# Altium schematic sheet FMCio_rowsCDGH.SchDoc
size Letter; PageSetup: Record=PageOptions|CenterHorizontal=True|CenterVertical=True|PrintScale=0.91|XCorrection=1.00|YCorrection=1.00|PrintKind=0|BorderSize=5000000|LeftOffset=0|BottomOffset=0|Orientation=2|PaperLength=1000|PaperWidth=1000|Scale=100|PaperSource=7|PrintQuality=-4|MediaType=1|DitherType=10|PaperKind=Letter|PrintScaleMode=1; Author: Adam Gilbert; CompanyName: McGill University; DrawnBy: Adam Gilbert; Organization: Altium Limited; Address1: McGill Cosmology; Address2: 3600 University Street; Address3: Montreal, Quebec; Address4: Canada; DocumentNumber: 12; Revision: Rev2; SheetNumber: 12; SheetTotal: 16; ProjectTitle: DfMux FMC Mezz; ModelNumber: MGMEZZ04; ProjectName: DfMux FMC Mezz
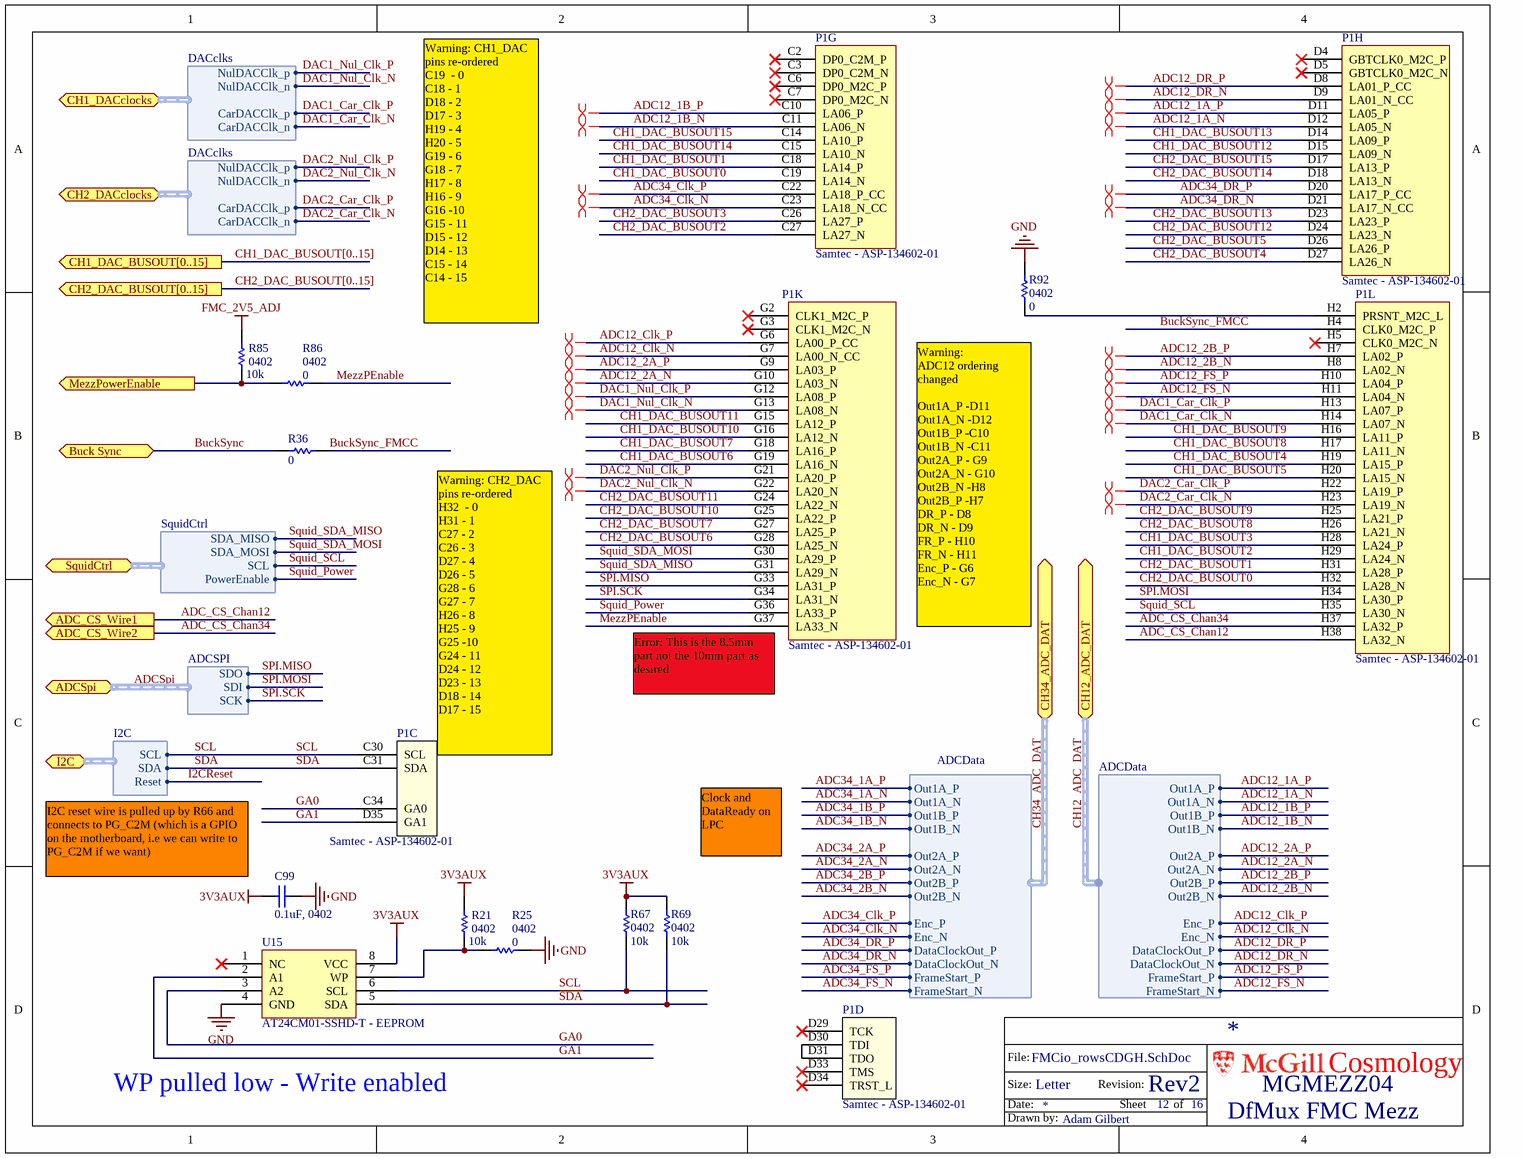
[diagram p0: FMCio_rowsCDGH.SchDoc]

## Parts
C99  0.1uF, 0402  [0402]
P1  Samtec - ASP-134602-01  [BTB-SM1-27-2V400M]  (parts C,D,G,H,K,L of 14)
R21  10k  [0402]
R25  0  [0402]
R36  0  [0805]
R67  10k  [0402]
R69  10k  [0402]
R85  10k  [0402]
R86  0  [0402]
R92  0  [0402]
U15  AT24CM01-SSHD-T - EEPROM  [SO8/L200]

## Ports
ADC_CS_Wire1 (out), ADC_CS_Wire2 (out), ADCSpi (harness ADCSPI), Buck Sync, CH1_DAC_BUSOUT[0..15] (out), CH1_DACclocks (harness DACclks), CH2_DAC_BUSOUT[0..15] (out), CH2_DACclocks (harness DACclks), CH12_ADC_DAT (harness ADCData), CH34_ADC_DAT (harness ADCData), I2C (harness I2C), MezzPowerEnable (out), SquidCtrl (harness SquidCtrl)

## Harnesses
I2C: SCL, SDA, Reset
ADCSPI: SDO, SDI, SCK
ADCData: Enc_P, Enc_N, Out1A_P, Out1A_N, Out1B_P, Out1B_N, Out2A_P, Out2A_N, Out2B_P, Out2B_N, DataClockOut_P, DataClockOut_N, FrameStart_P, FrameStart_N
DACclks: NulDACClk_p, NulDACClk_n, CarDACClk_p, CarDACClk_n
SquidCtrl: SDA_MISO, SDA_MOSI, SCL, PowerEnable

## Nets
3V3AUX: C99.1 R21.1 R67.1 R69.1 U15.8(VCC)
FMC_2V5_ADJ: R85.1
GND: C99.2 R25.2 R92.2 U15.4(GND)
~{SDA}: P1.C31(SDA) R69.2 U15.5(SDA) ; port I2C.SDA  [also labelled SDA]
ADC12_1A_N: P1.D12(LA05_N) ; port CH12_ADC_DAT.Out1A_N
ADC12_1A_P: P1.D11(LA05_P) ; port CH12_ADC_DAT.Out1A_P
ADC12_1B_N: P1.C11(LA06_N) ; port CH12_ADC_DAT.Out1B_N
ADC12_1B_P: P1.C10(LA06_P) ; port CH12_ADC_DAT.Out1B_P
ADC12_2A_N: P1.G10(LA03_N) ; port CH12_ADC_DAT.Out2A_N
ADC12_2A_P: P1.G9(LA03_P) ; port CH12_ADC_DAT.Out2A_P
ADC12_2B_N: P1.H8(LA02_N) ; port CH12_ADC_DAT.Out2B_N
ADC12_2B_P: P1.H7(LA02_P) ; port CH12_ADC_DAT.Out2B_P
ADC12_Clk_N: P1.G7(LA00_N_CC) ; port CH12_ADC_DAT.Enc_N
ADC12_Clk_P: P1.G6(LA00_P_CC) ; port CH12_ADC_DAT.Enc_P
ADC12_DR_N: P1.D9(LA01_N_CC) ; port CH12_ADC_DAT.DataClockOut_N
ADC12_DR_P: P1.D8(LA01_P_CC) ; port CH12_ADC_DAT.DataClockOut_P
ADC12_FS_N: P1.H11(LA04_N) ; port CH12_ADC_DAT.FrameStart_N
ADC12_FS_P: P1.H10(LA04_P) ; port CH12_ADC_DAT.FrameStart_P
ADC34_1A_N: port CH34_ADC_DAT.Out1A_N
ADC34_1A_P: port CH34_ADC_DAT.Out1A_P
ADC34_1B_N: port CH34_ADC_DAT.Out1B_N
ADC34_1B_P: port CH34_ADC_DAT.Out1B_P
ADC34_2A_N: port CH34_ADC_DAT.Out2A_N
ADC34_2A_P: port CH34_ADC_DAT.Out2A_P
ADC34_2B_N: port CH34_ADC_DAT.Out2B_N
ADC34_2B_P: port CH34_ADC_DAT.Out2B_P
ADC34_Clk_N: P1.C23(LA18_N_CC) ; port CH34_ADC_DAT.Enc_N
ADC34_Clk_P: P1.C22(LA18_P_CC) ; port CH34_ADC_DAT.Enc_P
ADC34_DR_N: P1.D21(LA17_N_CC) ; port CH34_ADC_DAT.DataClockOut_N
ADC34_DR_P: P1.D20(LA17_P_CC) ; port CH34_ADC_DAT.DataClockOut_P
ADC34_FS_N: port CH34_ADC_DAT.FrameStart_N
ADC34_FS_P: port CH34_ADC_DAT.FrameStart_P
ADC_CS_Chan12: P1.H38(LA32_N) ; port ADC_CS_Wire1
ADC_CS_Chan34: P1.H37(LA32_P) ; port ADC_CS_Wire2
BuckSync: R36.2 ; port Buck Sync
BuckSync_FMCC: P1.H4(CLK0_M2C_P) R36.1
CH1_DAC_BUSOUT0: P1.C19(LA14_N)
CH1_DAC_BUSOUT1: P1.C18(LA14_P)
CH1_DAC_BUSOUT2: P1.H29(LA24_N)
CH1_DAC_BUSOUT3: P1.H28(LA24_P)
CH1_DAC_BUSOUT4: P1.H19(LA15_P)
CH1_DAC_BUSOUT5: P1.H20(LA15_N)
CH1_DAC_BUSOUT6: P1.G19(LA16_N)
CH1_DAC_BUSOUT7: P1.G18(LA16_P)
CH1_DAC_BUSOUT8: P1.H17(LA11_N)
CH1_DAC_BUSOUT9: P1.H16(LA11_P)
CH1_DAC_BUSOUT10: P1.G16(LA12_N)
CH1_DAC_BUSOUT11: P1.G15(LA12_P)
CH1_DAC_BUSOUT12: P1.D15(LA09_N)
CH1_DAC_BUSOUT13: P1.D14(LA09_P)
CH1_DAC_BUSOUT14: P1.C15(LA10_N)
CH1_DAC_BUSOUT15: P1.C14(LA10_P)
CH2_DAC_BUSOUT0: P1.H32(LA28_N)
CH2_DAC_BUSOUT1: P1.H31(LA28_P)
CH2_DAC_BUSOUT2: P1.C27(LA27_N)
CH2_DAC_BUSOUT3: P1.C26(LA27_P)
CH2_DAC_BUSOUT4: P1.D27(LA26_N)
CH2_DAC_BUSOUT5: P1.D26(LA26_P)
CH2_DAC_BUSOUT6: P1.G28(LA25_N)
CH2_DAC_BUSOUT7: P1.G27(LA25_P)
CH2_DAC_BUSOUT8: P1.H26(LA21_N)
CH2_DAC_BUSOUT9: P1.H25(LA21_P)
CH2_DAC_BUSOUT10: P1.G25(LA22_P)
CH2_DAC_BUSOUT11: P1.G24(LA22_N)
CH2_DAC_BUSOUT12: P1.D24(LA23_N)
CH2_DAC_BUSOUT13: P1.D23(LA23_P)
CH2_DAC_BUSOUT14: P1.D18(LA13_N)
CH2_DAC_BUSOUT15: P1.D17(LA13_P)
DAC1_Car_Clk_N: P1.H14(LA07_N) ; port CH1_DACclocks.CarDACClk_n
DAC1_Car_Clk_P: P1.H13(LA07_P) ; port CH1_DACclocks.CarDACClk_p
DAC1_Nul_Clk_N: P1.G13(LA08_N) ; port CH1_DACclocks.NulDACClk_n
DAC1_Nul_Clk_P: P1.G12(LA08_P) ; port CH1_DACclocks.NulDACClk_p
DAC2_Car_Clk_N: P1.H23(LA19_N) ; port CH2_DACclocks.CarDACClk_n
DAC2_Car_Clk_P: P1.H22(LA19_P) ; port CH2_DACclocks.CarDACClk_p
DAC2_Nul_Clk_N: P1.G22(LA20_N) ; port CH2_DACclocks.NulDACClk_n
DAC2_Nul_Clk_P: P1.G21(LA20_P) ; port CH2_DACclocks.NulDACClk_p
GA0: P1.C34(GA0) U15.3(A2)
GA1: P1.D35(GA1) U15.2(A1)
I2CReset: port I2C.Reset
MezzPEnable: P1.G37(LA33_N) R86.2
MezzPowerEnable: R85.2 R86.1 ; port MezzPowerEnable
SCL: P1.C30(SCL) R67.2 U15.6(SCL) ; port I2C.SCL
SPI.MISO: P1.G33(LA31_P) ; port ADCSpi.SDO  [project net ADCSpi.SDO]
SPI.MOSI: P1.H34(LA30_P) ; port ADCSpi.SDI  [project net ADCSpi.SDI]
SPI.SCK: P1.G34(LA31_N) ; port ADCSpi.SCK  [project net ADCSpi.SCK]
Squid_Power: P1.G36(LA33_P) ; port SquidCtrl.PowerEnable
Squid_SCL: P1.H35(LA30_N) ; port SquidCtrl.SCL
Squid_SDA_MISO: P1.G31(LA29_N) ; port SquidCtrl.SDA_MISO
Squid_SDA_MOSI: P1.G30(LA29_P) ; port SquidCtrl.SDA_MOSI
NetP1_D30: P1.D30(TDI) P1.D31(TDO)
NetP1_H2: P1.H2(PRSNT_M2C_L) R92.1
NetR21_2: R21.2 R25.1 U15.7(WP)

Not connected (* = marked no-connect by the designer): P1 C2(DP0_C2M_P)* C3(DP0_C2M_N)* C6(DP0_M2C_P)* C7(DP0_M2C_N)* D4(GBTCLK0_M2C_P)* D5(GBTCLK0_M2C_N)* D29(TCK)* D33(TMS)* D34(TRST_L)* G2(CLK1_M2C_P)* G3(CLK1_M2C_N)* H5(CLK0_M2C_N)*; U15 1(NC)*

## Buses and harness runs
bus CH1_DAC_BUSOUT[0..15] = port CH1_DAC_BUSOUT[0..15]
bus CH2_DAC_BUSOUT[0..15] = port CH2_DAC_BUSOUT[0..15]
harness ADCSpi = port ADCSpi
harness CH12_ADC_DAT = port CH12_ADC_DAT
harness CH34_ADC_DAT = port CH34_ADC_DAT

## Layout directives
differential pair: ADC12_1A_N, ADC12_1A_P, ADC12_1B_N, ADC12_1B_P, ADC12_2A_N, ADC12_2A_P, ADC12_2B_N, ADC12_2B_P, ADC12_Clk_N, ADC12_Clk_P, ADC12_DR_N, ADC12_DR_P, ADC12_FS_N, ADC12_FS_P, ADC34_Clk_N, ADC34_Clk_P, ADC34_DR_N, ADC34_DR_P, DAC1_Car_Clk_N, DAC1_Car_Clk_P, DAC1_Nul_Clk_N, DAC1_Nul_Clk_P, DAC2_Car_Clk_N, DAC2_Car_Clk_P, DAC2_Nul_Clk_N, DAC2_Nul_Clk_P

## Notes on the sheet
- Warning: CH1_DAC pins re-ordered
  C19  - 0
  C18 - 1
  D18 - 2
  D17 - 3
  H19 - 4
  H20 - 5
  G19 - 6
  G18 - 7
  H17 - 8
  H16 - 9
  G16 -10
  G15 - 11
  D15 - 12
  D14 - 13
  C15 - 14
  C14 - 15
- (near R92) Warning:
  ADC12 ordering changed
  Out1A_P -D11
  Out1A_N -D12
  Out1B_P -C10
  Out1B_N -C11
  Out2A_P - G9
  Out2A_N - G10
  Out2B_N -H8
  Out2B_P -H7
  DR_P - D8
  DR_N - D9
  FR_P - H10
  FR_N - H11
  Enc_P - G6
  Enc_N - G7
- (near P1) Error: This is the 8.5mm part not the 10mm part as desired
- (near P1) Warning: CH2_DAC pins re-ordered
  H32  - 0
  H31 - 1
  C27 - 2
  C26 - 3
  D27 - 4
  D26 - 5
  G28 - 6
  G27 - 7
  H26 - 8
  H25 - 9
  G25 -10
  G24 - 11
  D24 - 12
  D23 - 13
  D18 - 14
  D17 - 15
- (near C99) I2C reset wire is pulled up by R66 and connects to PG_C2M (which is a GPIO on the motherboard, i.e we can write to PG_C2M if we want)
- Clock and DataReady on LPC
- WP pulled low - Write enabled
- File:
- Size:
- Date:
- Letter
- Revision:
- Sheet
- of
- Cosmology
- Drawn by:

## Library data of the parts
C99 = CAP 0603: Capacitor, Ceramic, 0402; Part Constraints: 10% 10V X5R 0402; Manufacturer: TDK Corporation; Manufacturer Part Number 1: C1005X5R1A104K050BA; Temperature Coefficient: X5R; Assembly Comments: none; Value: 0.1uF, 0402; Supplier 1: Digi-Key; Supplier Part Number 1: 445-1265-1-ND; Operating Temperature: -55°C ~ 85°C; Thickness (Max): 0.022" (0.55mm); Packaging: Cut Tape (CT)
P1 = Samtec - ASP-134602-01: Samtec ASP-134602-01; Assembly Comments: none; Manufacturer: Samtec; Part constraints: Samtec ASP-134602-01; Manufacturer Part Number 1: Samtec ASP-134602-01
R21 R25 R67 R69 R85 R86 R92 = RES 0402: Resistor; Manufacturer: Generic; Part Constraints: 1% 1/10W 100ppm 0402; Assembly Comments: none; Manufacturer Part Number 1: Generic
  R21 R67 R69 R85: Value: 10k
  R25 R86 R92: Value: 0
R36 = Res1812: RES 0.0 OHM 1/8W 0805 SMD; Manufacturer: e.g Vishay/Dale; Part constraints: 0Ohm jumper, >=4A, 0805, <=5mOhms; Manufacturer Part Number 1: e.g CRCW08050000Z0EAHP; Assembly Comments: none; Value: 0; Supplier 1: Newark; Supplier Part Number 1: 68R2993
U15 = AT24C1024B: IC EEPROM 1MBIT 1MHZ 8SOIC; Manufacturer: Atmel; Assembly Comments: none; Part constraints: AT24CM01-SSHD-T; Manufacturer Part Number 1: AT24CM01-SSHD-T; Supplier 1: Digikey; Supplier Part Number 1: AT24CM01-SSHD-TCT-ND